# Altium schematic sheet LD_driver.SchDoc
size 420 x 297 mm; Address1: Address1; Address2: Address2; Address3: Address3; Address4: Address4; DocumentNumber: *Э3; SheetNumber: 6; SheetTotal: 15; DocumentType: Схема электрическая *
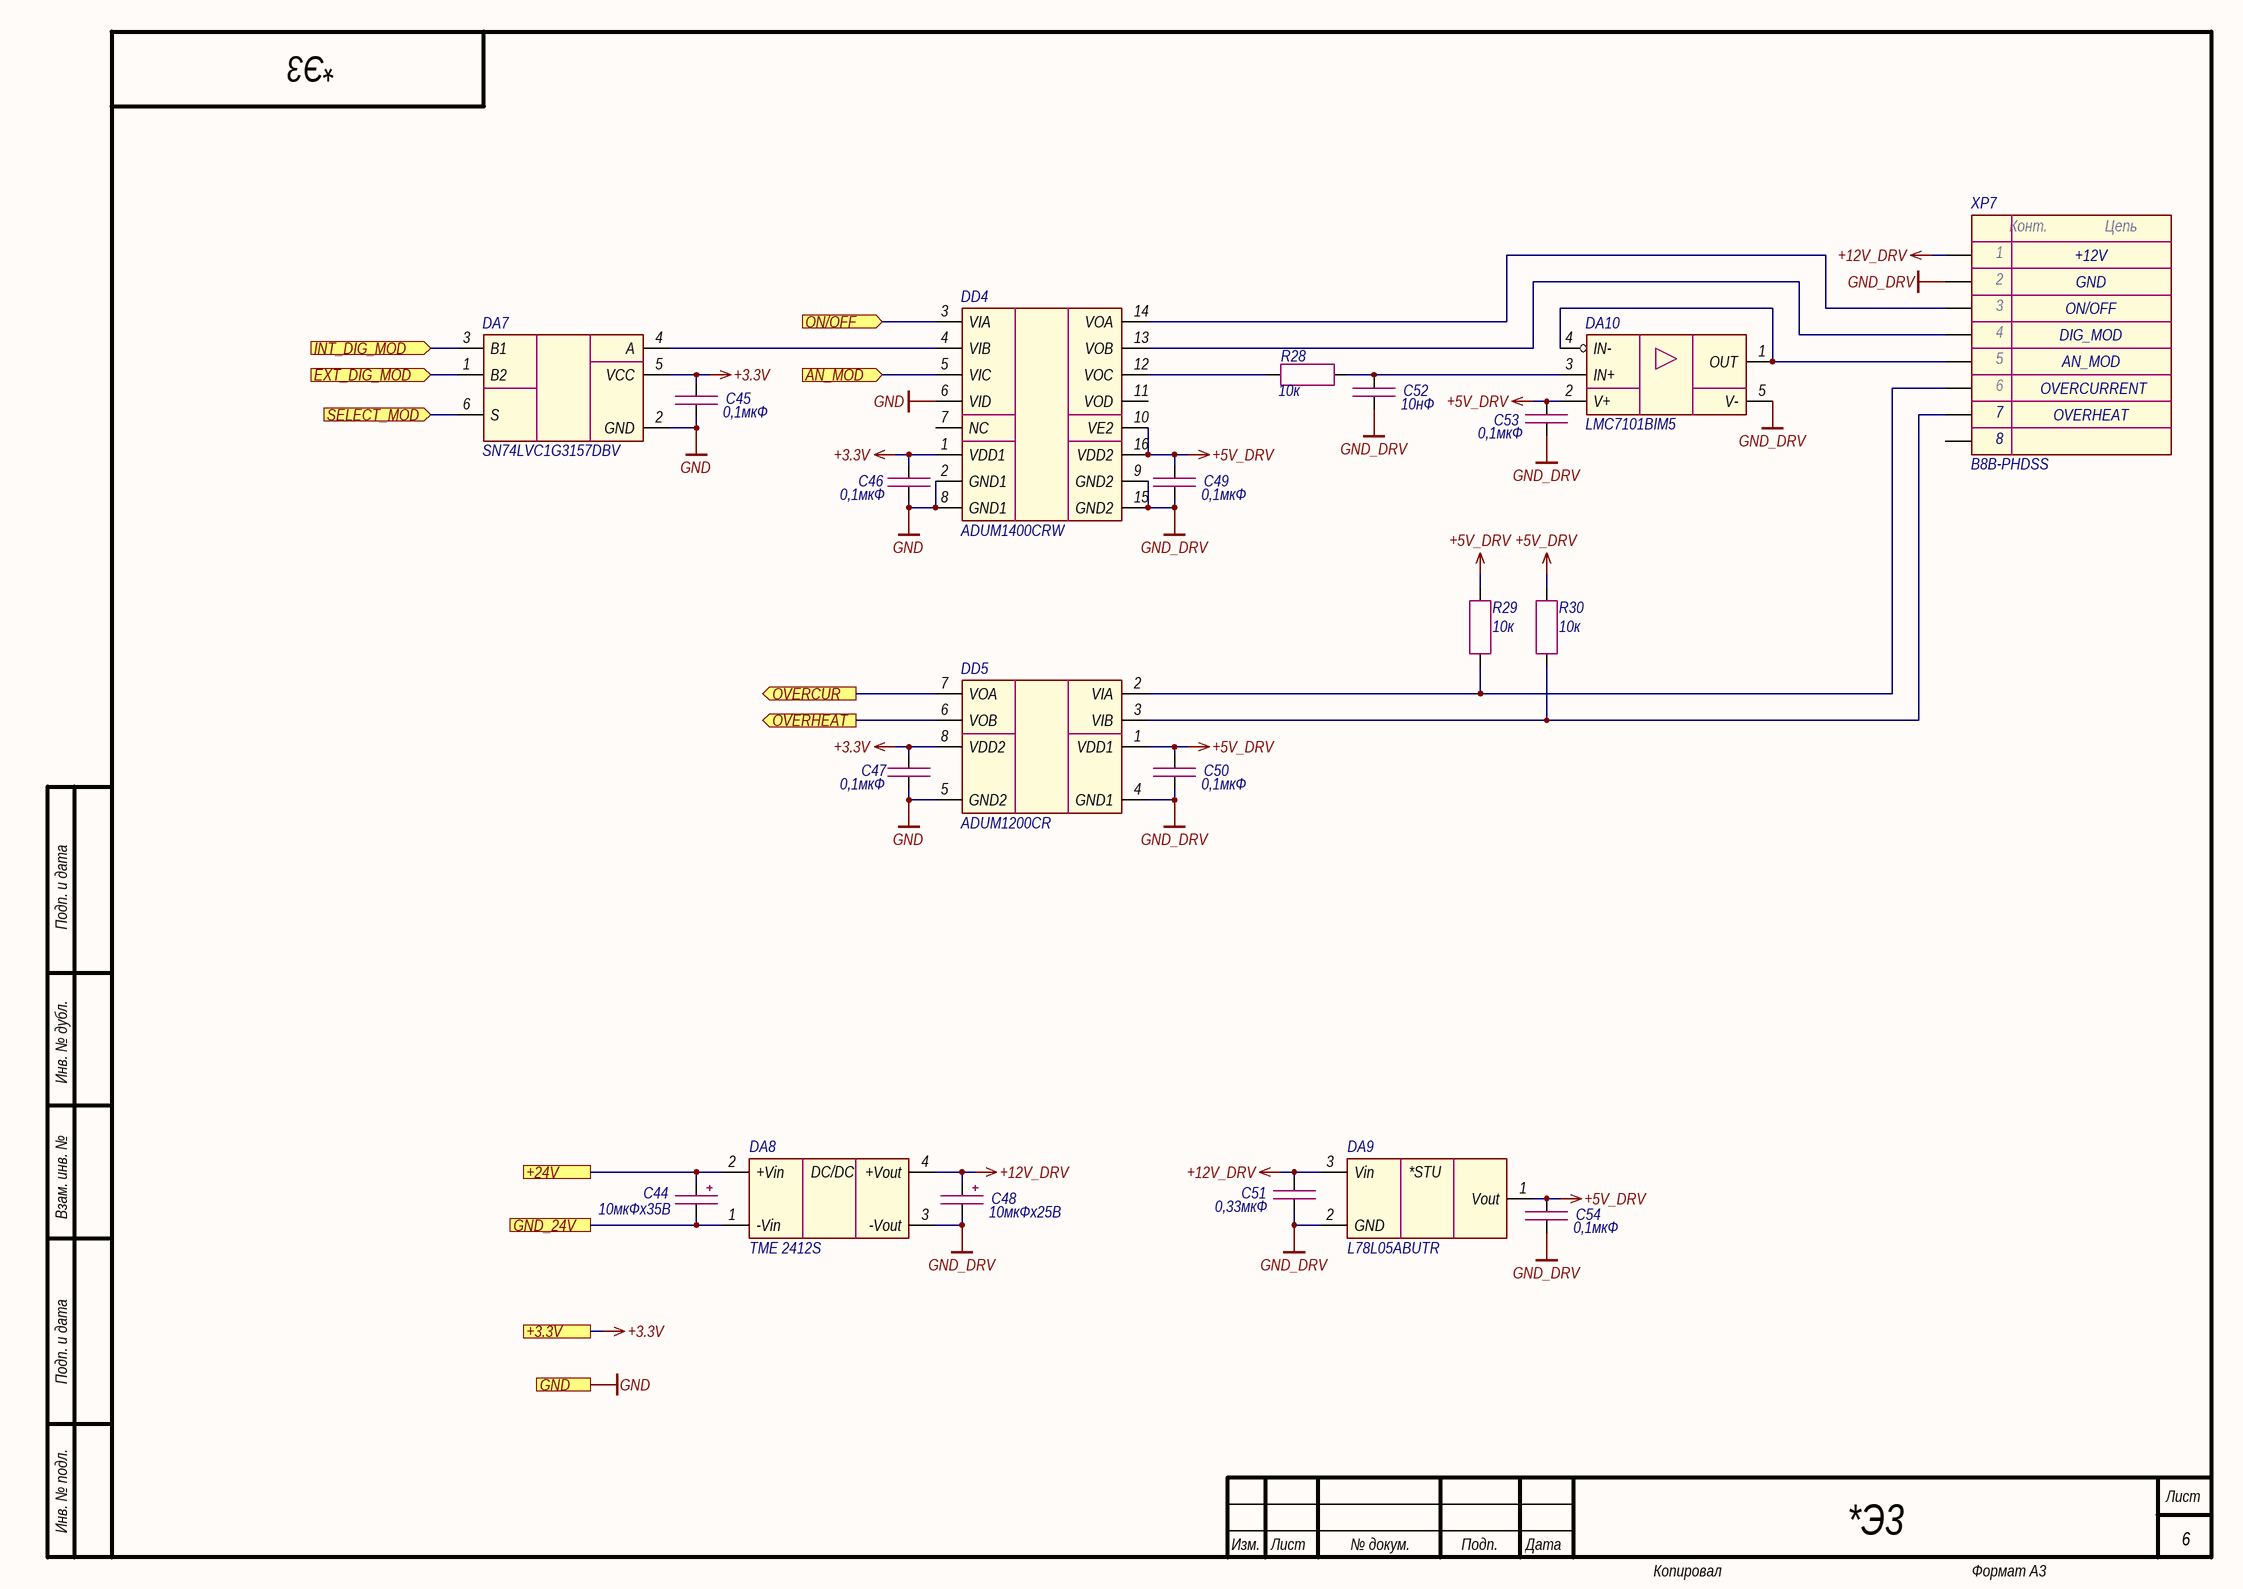
[diagram p0: LD_driver.SchDoc]

## Parts
C44  10мкФх35B  [CAP_C]
C45  0,1мкФ  [CAP_0603]
C46  0,1мкФ  [CAP_0603]
C47  0,1мкФ  [CAP_0603]
C48  10мкФх25B  [CAP_B]
C49  0,1мкФ  [CAP_0603]
C50  0,1мкФ  [CAP_0603]
C51  0,33мкФ  [CAP_0805]
C52  10нФ  [CAP_0603]
C53  0,1мкФ  [CAP_0603]
C54  0,1мкФ  [CAP_0603]
DA7  SN74LVC1G3157DBV  [SOT-23-6]
DA8  TME 2412S  [TME (SIP-4)]
DA9  L78L05ABUTR  [SOT-89]
DA10  LMC7101BIM5  [SOT-23-5]
DD4  ADUM1400CRW  [SOIC-16W]
DD5  ADUM1200CR  [SOIC-8]
R28  10к  [RES_0603]
R29  10к  [RES_0603]
R30  10к  [RES_0603]
XP7  B8B-PHDSS  [B8B-PHDSS]

## Ports
+3.3V (see Main[2A], Button[1D], Ethernet[3D], Fiber_interlock[2C], Flow_sensor[2C], Hardwiring[3D], Power_supply[1D], Power_supply_CAN[1D], SF_driver[2C]), +24V (see Main[2A], Button[1C], Column[1C], Flow_sensor[2C], Hardwiring[3C], Indication[1C], Power_supply[1D], Power_supply_CAN[1D]), AN_MOD (in, see Main[2A]), EXT_DIG_MOD (in, see Main[2A]), GND (see Main[2A], Button[1D], Column[1C], Ethernet[3D], Fiber_interlock[2C], Flow_sensor[2C], Guide_laser[1C], Hardwiring[3D], Indication[1C], Power_supply[1D], Power_supply_CAN[1D], SF_driver[2D]), GND_24V (see Main[2A], Button[1D], Column[1C], Flow_sensor[2C], Hardwiring[3C], Indication[1C], Power_supply[1D], Power_supply_CAN[1D]), INT_DIG_MOD (in, see Main[2A]), ON/OFF (in, see Main[2A]), OVERCUR (out, see Main[2A]), OVERHEAT (out, see Main[2A]), SELECT_MOD (in, see Main[2A])

## Nets
+3.3V: C45.1 C46.1 C47.1 DA7.5(VCC) DD4.1(VDD1) DD5.8(VDD2) ; port +3.3V
+5V_DRV: C49.1 C50.1 C53.1 C54.1 DA9.1(Vout) DA10.2(V+) DD4.10(VE2) DD4.16(VDD2) DD5.1(VDD1) R29.1 R30.1
+12V_DRV: C48.1 C51.2 DA8.4(+Vout) DA9.3(Vin) XP7.1
GND: C45.2 C46.2 C47.2 DA7.2(GND) DD4.2(GND1) DD4.6(VID) DD4.8(GND1) DD5.5(GND2) ; port GND
GND_DRV: C48.2 C49.2 C50.2 C51.1 C52.2 C53.2 C54.2 DA8.3(-Vout) DA9.2(GND) DA10.5(V-) DD4.9(GND2) DD4.15(GND2) DD5.4(GND1) XP7.2
+24V: C44.1 DA8.2(+Vin) ; port +24V
AN_MOD: DD4.5(VIC) ; port AN_MOD
EXT_DIG_MOD: DA7.1(B2) ; port EXT_DIG_MOD
GND_24V: C44.2 DA8.1(-Vin) ; port GND_24V
INT_DIG_MOD: DA7.3(B1) ; port INT_DIG_MOD
ON/OFF: DD4.3(VIA) ; port ON/OFF
OVERCUR: DD5.7(VOA) ; port OVERCUR
OVERHEAT: DD5.6(VOB) ; port OVERHEAT
SELECT_MOD: DA7.6(S) ; port SELECT_MOD
NetC52_1: C52.1 DA10.3(IN+) R28.2
NetDA7_4: DA7.4(A) DD4.4(VIB)
NetDA10_1: DA10.1(OUT) DA10.4(IN-) XP7.5
NetDD4_12: DD4.12(VOC) R28.1
NetDD4_13: DD4.13(VOB) XP7.4
NetDD4_14: DD4.14(VOA) XP7.3
NetDD5_2: DD5.2(VIA) R29.2 XP7.6
NetDD5_3: DD5.3(VIB) R30.2 XP7.7

Not connected (* = marked no-connect by the designer): DD4 7(NC) 11(VOD); XP7 8

## Notes on the sheet
- +12V
- ON/OFF
- DIG_MOD
- GND
- AN_MOD
- OVERCURRENT
- OVERHEAT
- Подп. и дата
- Инв. № дубл.
- Взам. инв. №
- Инв. № подл.
- Изм.
- Лист
- № докум.
- Подп.
- Дата
- Копировал
- Формат А3
- (in symbol Connector-8) Конт.; Цепь
- (in symbol LD2981ABU50TR) *STU
- (in symbol TME) DC/DC

## Library data of the parts
C44 = Capacitor_Polar: Model: TECAP, 10 мкФ, 35 В, тип C, 10%; Value: 10мкФх35B; Document: *; Manufacturer: *
C45-C47 C49 C50 C53 C54 = Capacitor: Manufacturer: Murata; Model: GRM188R71H104KA93D; Value: 0,1мкФ; Document: *
C48 = Capacitor_Polar: Model: TECAP, 10 мкФ, 25 В, тип B, 10%; Value: 10мкФх25B; Document: *; Manufacturer: *
C51 = Capacitor: Manufacturer: Murata; Model: GRM219R71H334KA88D; Value: 0,33мкФ; Document: *
C52 = Capacitor: Manufacturer: Murata; Model: GRM188R71H103JA01D; Value: 10нФ; Document: *
DA7 = SN74LVC1G3157: Manufacturer: Texas Instruments; Model: SN74LVC1G3157DBV; Document: *
DA8 = TME: Manufacturer: Traco Power; Model: TME 2412S; Document: *
DA9 = LD2981ABU50TR: Manufacturer: STMicroelectronics; Model: L78L05ABUTR; Document: *
DA10 = LMC7101: Manufacturer: Texas Instruments; Model: LMC7101BIM5; Document: *
DD4 = ADUM1400: Manufacturer: Analog Devices; Model: ADUM1400CRW; Document: *
DD5 = ADUM1200: Manufacturer: Analog Devices; Model: ADUM1200CR; Document: *
R28-R30 = Resistor: Manufacturer: Yageo; Model: RC0603FR-0710KL; Value: 10к; Document: *
XP7 = Connector-8: Manufacturer: JST; Model: B8B-PHDSS; Document: *